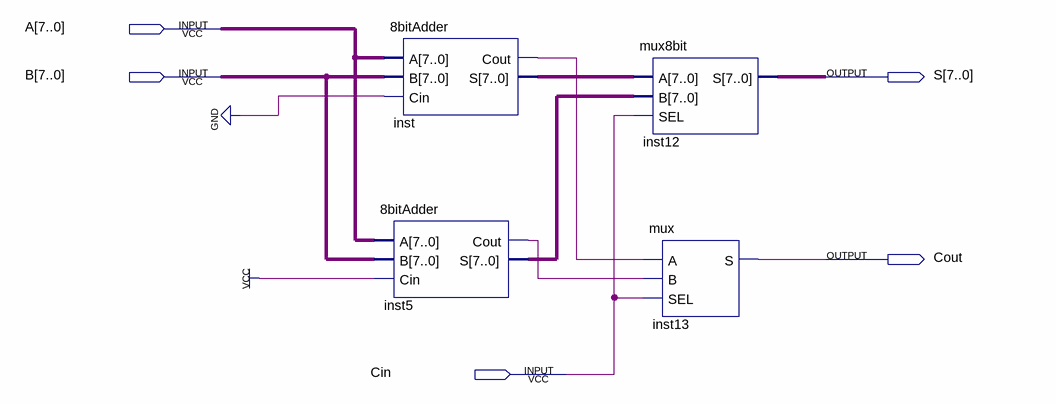
[diagram p0: schematic sheet]
// Quartus schematic 8bitCSA.bdf as structural Verilog: 4 symbols, 5 pins
module \8bitCSA  (
  input  [7:0] A,
  input  [7:0] B,
  input  Cin,
  output [7:0] S,
  output Cout
);

  wire inst5_cout, inst_cout;
  wire [7:0] inst5_s, inst_s;

  \8bitAdder  inst (.A(A), .B(B), .Cin(1'b0), .Cout(inst_cout), .S(inst_s));
  \8bitAdder  inst5 (.A(A), .B(B), .Cin(1'b1), .Cout(inst5_cout), .S(inst5_s));
  mux8bit inst12 (.A(inst_s), .B(inst5_s), .SEL(Cin), .S(S));
  mux inst13 (.A(inst_cout), .B(inst5_cout), .SEL(Cin), .S(Cout));
endmodule
